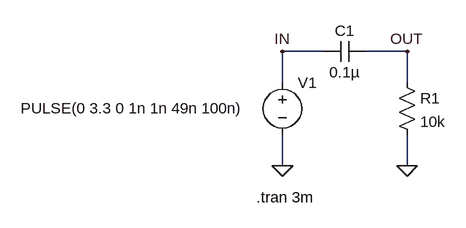
[diagram p0: schematic 方波链路的交流耦合与稳态响应仿真.asc]
方波链路的交流耦合与稳态响应仿真.asc, the LTspice schematic file:
Version 4.1
SHEET 1 880 680
WIRE 160 80 96 80
WIRE 288 80 224 80
WIRE 96 128 96 80
WIRE 288 128 288 80
WIRE 96 256 96 208
WIRE 288 256 288 208
FLAG 96 256 0
FLAG 288 256 0
FLAG 96 80 IN
FLAG 288 80 OUT
SYMBOL voltage 96 112 R0
WINDOW 3 -403 55 Left 2
WINDOW 123 0 0 Left 0
WINDOW 39 0 0 Left 0
SYMATTR InstName V1
SYMATTR Value PULSE(0 3.3 0 1n 1n 49n 100n)
SYMBOL cap 224 64 R90
WINDOW 0 0 32 VBottom 2
WINDOW 3 32 32 VTop 2
SYMATTR InstName C1
SYMATTR Value 0.1µ
SYMBOL res 272 112 R0
SYMATTR InstName R1
SYMATTR Value 10k
TEXT 56 304 Left 2 !.tran 3m

The netlist it stands for:
* 方波链路的交流耦合与稳态响应仿真.asc
V1 IN 0 PULSE(0 3.3 0 1n 1n 49n 100n)
C1 OUT IN 0.1µ
R1 OUT 0 10k
.tran 3m
.backanno
.end